# EasyEDA schematic SCH_csgo-bomb_2023-04-01.json
TITLE: CS:GO Bomb - Circuit Design; REV: 1.0; Date: 2023-03-26; Sheet: 1/1; Drawn By: leekycauldron; Company: leekycauldron
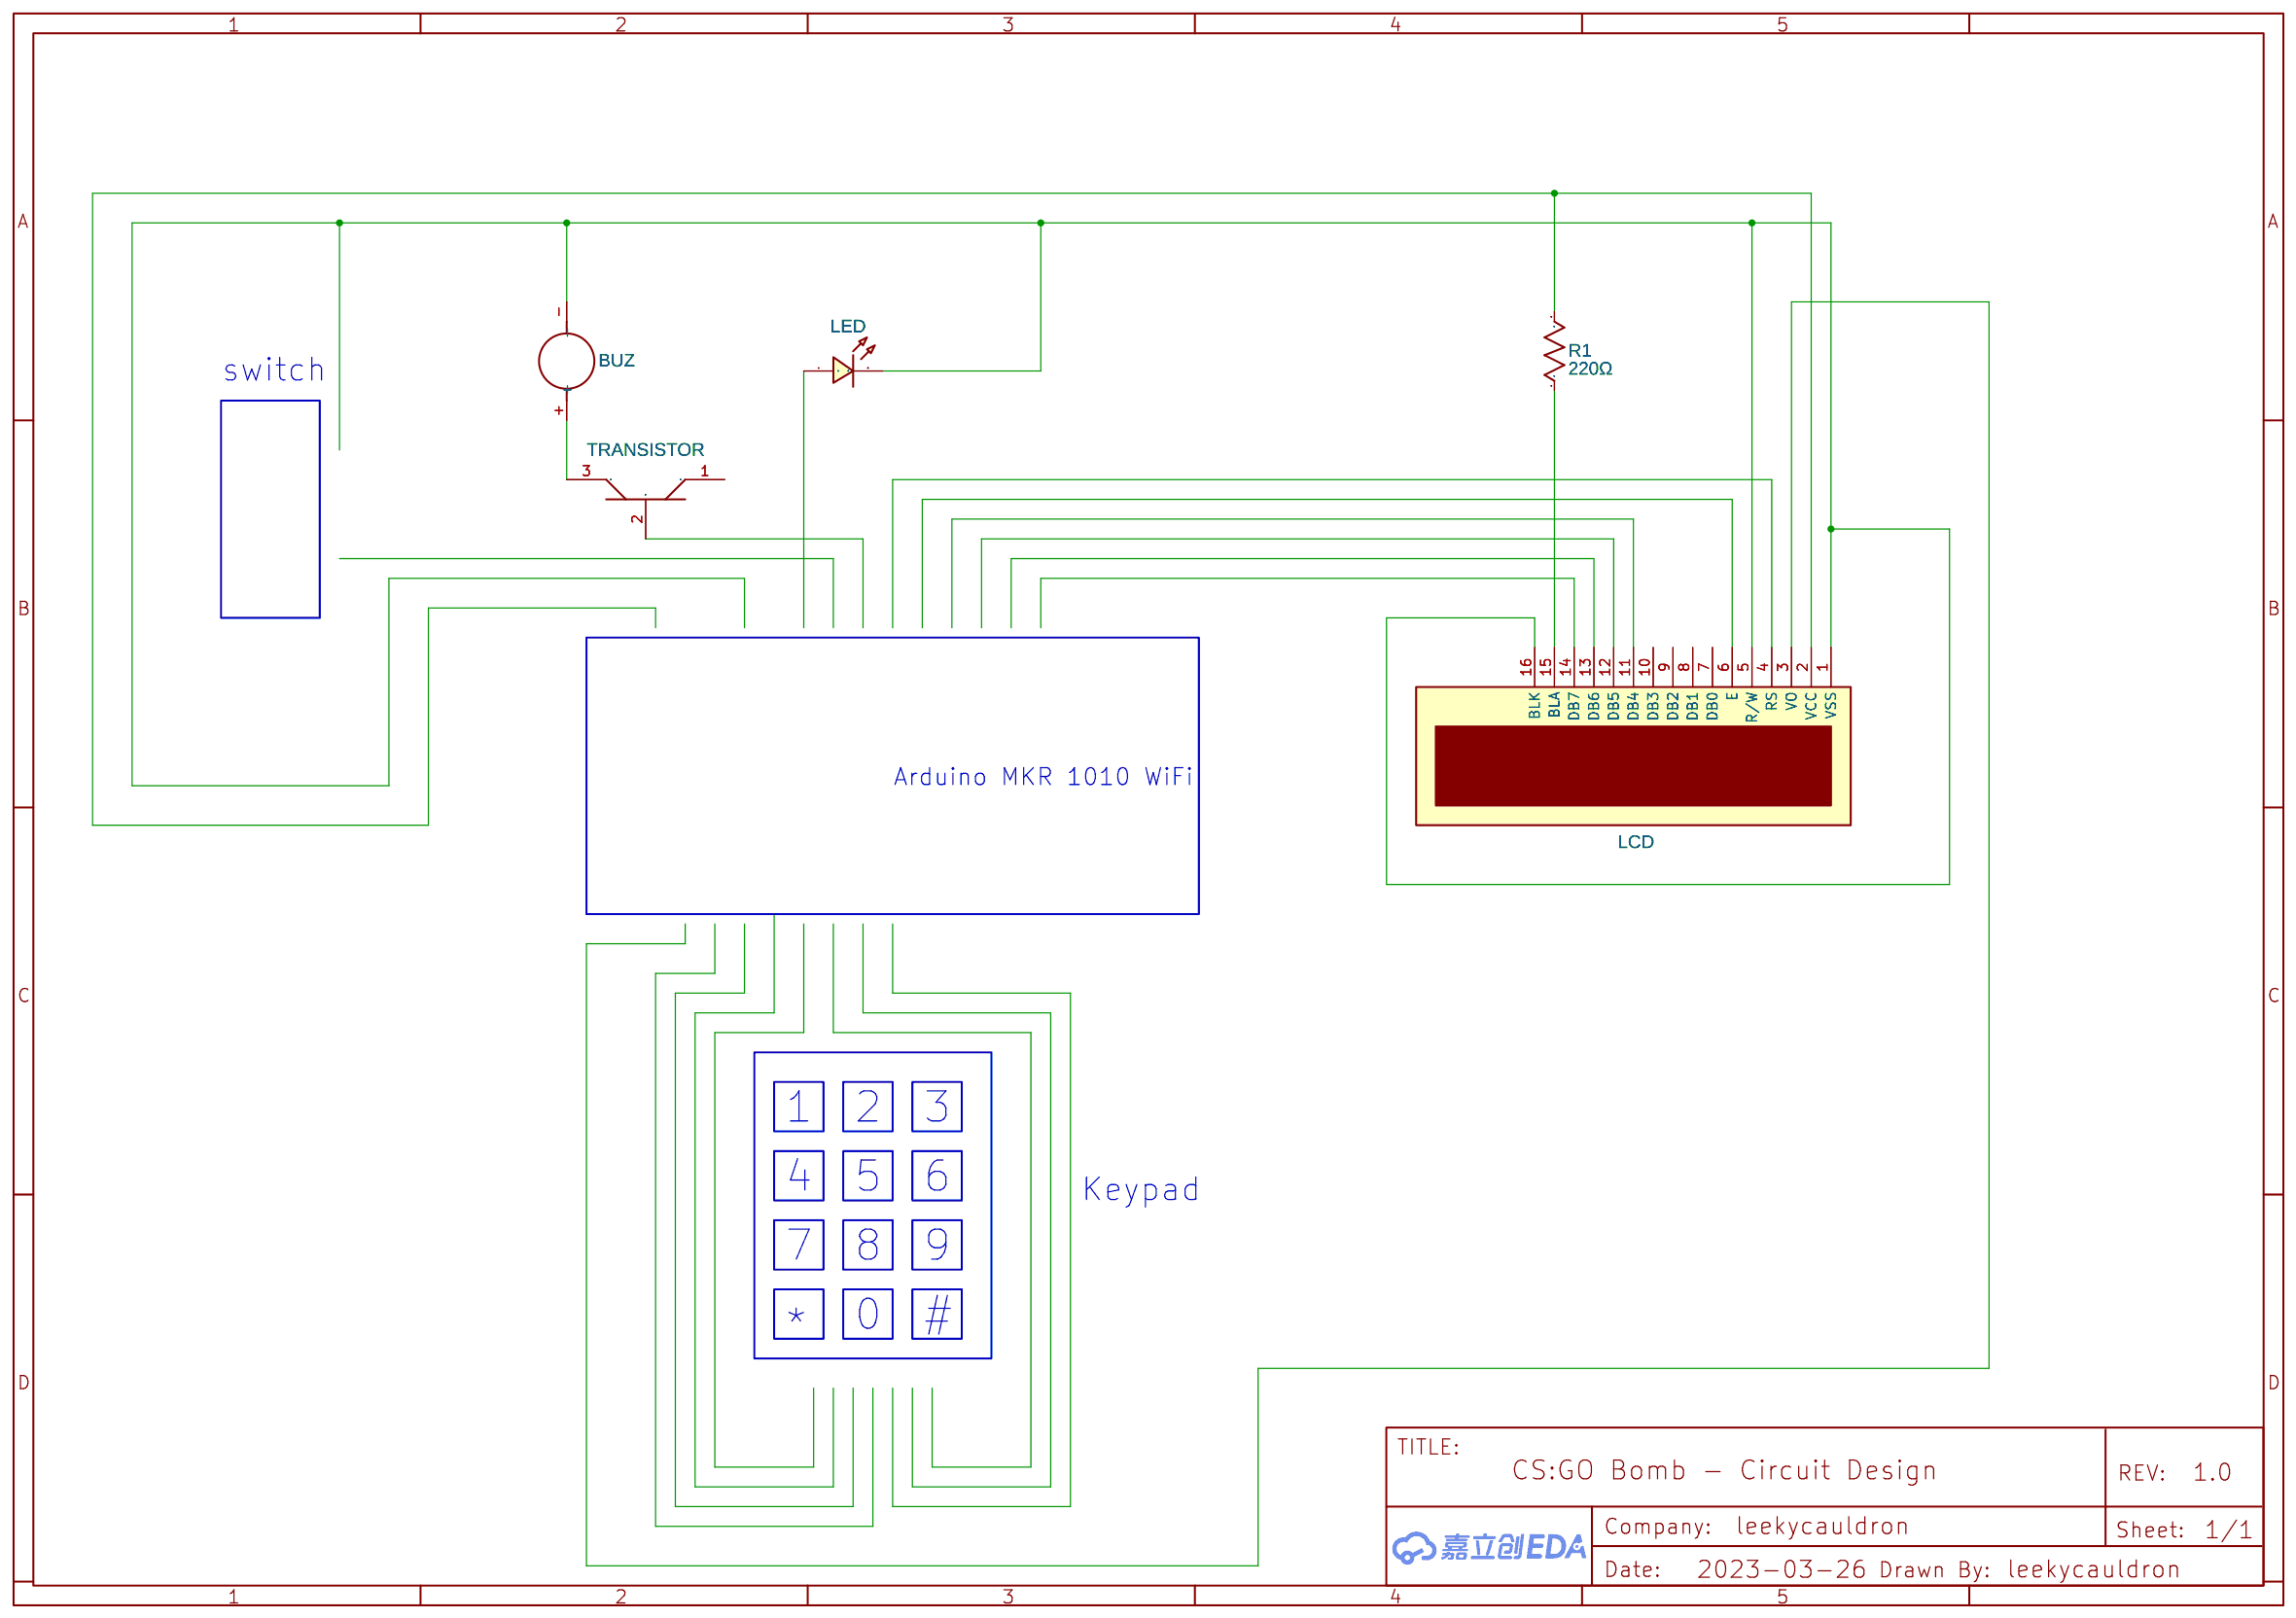
[diagram p0: schematic sheet]

## Parts
BUZ  KS-12065D03YA  [BZ2-7.6-D12.0XH6.5MM]
LCD  LCD1602  [LCD1602]
LED  LED-0603_R  [LED0603_RED]
Q1  TRANSISTOR  [TRANSISTOR]
R1  220Ω  [R0603]

## Library data of the parts
BUZ = KS-12065D03YA: DIP Buzzer 3V-30mA- 2700
LCD = LCD1602: Manufacturer: LONTECH(厦门龙特); Manufacturer Part: LCM1602K-NSW-BBW; Supplier Part: C83275; Supplier: LCSC; Contributor: LCEDA_Lib
LED = LED-0603_R: Manufacturer: EVERLIGHT(台湾亿光); Manufacturer Part: 19-217/R6C-AL1M2VY/3T; Supplier Part: C72044; Supplier: LCSC; Contributor: LCEDA_01
Q1 = TRANSISTOR: Contributor: Thib035
R1 = R_0603_US: Contributor: LCEDA_Lib

## Nets
Net-(BUZ-+): BUZ.+ Q1.3
Net-(BUZ--): BUZ.- LCD.1(VSS) LCD.5(R/W) LCD.16(BLK) LED.2
Net-(LCD-2): LCD.2(VCC) R1.2
Net-(LCD-15): LCD.15(BLA) R1.1

Not connected (* = marked no-connect by the designer): LCD 3(VO) 4(RS) 6(E) 7(DB0) 8(DB1) 9(DB2) 10(DB3) 11(DB4) 12(DB5) 13(DB6) 14(DB7); LED 1; Q1 1 2

## Notes on the sheet
- switch
- Arduino MKR 1010 WiFi
- 1
- 2
- 3
- 4
- 5
- 6
- Keypad
- 7
- 8
- 9
- *
- 0
- #
